# Altium schematic sheet type-C.SchDoc
size A4; SheetNumber: 2; SheetTotal: 2
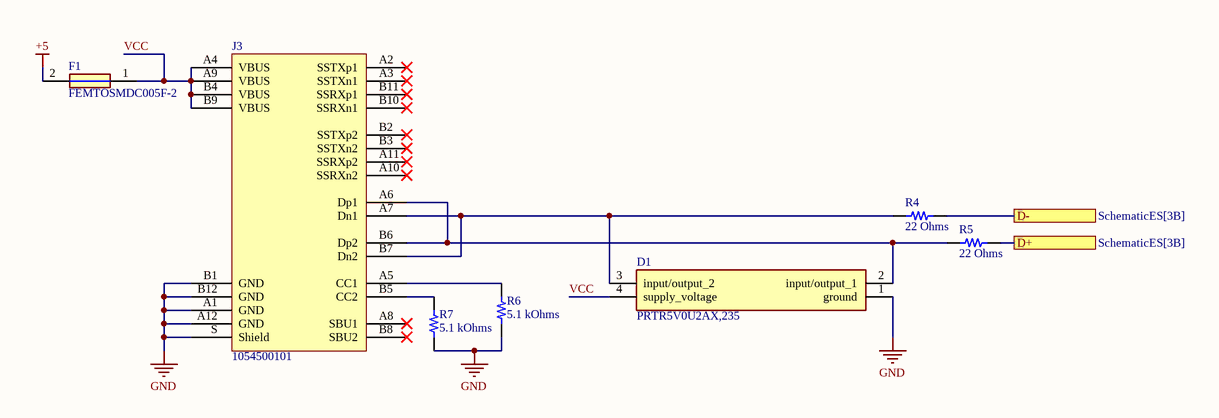
[diagram p0: type-C.SchDoc]

## Parts
D1  PRTR5V0U2AX,235  [PRTR5V0U2X]
F1  FEMTOSMDC005F-2  [FUSC1608X85N]
J3  1054500101  [Molex 1054500101]
R4  22 Ohms  [RES 0805_2012]
R5  22 Ohms  [RES 0805_2012]
R6  5.1 kOhms  [RES 0805_2012]
R7  5.1 kOhms  [RES 0805_2012]

## Ports
D+ (see SchematicES[3B]), D- (see SchematicES[3B])

## Nets
+5: F1.2
GND: D1.1(ground) J3.A1(GND) J3.A12(GND) J3.B1(GND) J3.B12(GND) J3.S(Shield) R6.2 R7.2
D+: R5.2 ; port D+
D-: R4.2 ; port D-
VCC: D1.4(supply_voltage) F1.1 J3.A4(VBUS) J3.A9(VBUS) J3.B4(VBUS) J3.B9(VBUS)
NetD1_2: D1.2(input/output_1) J3.A6(Dp1) J3.B6(Dp2) R5.1
NetD1_3: D1.3(input/output_2) J3.A7(Dn1) J3.B7(Dn2) R4.1
NetJ3_A5: J3.A5(CC1) R6.1
NetJ3_B5: J3.B5(CC2) R7.1

Not connected (* = marked no-connect by the designer): J3 A2(SSTXp1)* A3(SSTXn1)* A8(SBU1)* A10(SSRXn2)* A11(SSRXp2)* B2(SSTXp2)* B3(SSTXn2)* B8(SBU2)* B10(SSRXn1)* B11(SSRXp1)*

## Notes on the sheet
- USB 3.0
  comectet as USB 2.0

## Library data of the parts
D1 = PRTR5V0U2AX,235: Diode; Manufacturer_Name: Nexperia; Datasheet Link: https://assets.nexperia.com/documents/data-sheet/PRTR5V0U2AX.pdf; Height: 1.1mm; Manufacturer_Part_Number: PRTR5V0U2AX,235; Mouser Part Number: 771-PRTR5V0U2AX,235; Mouser Price/Stock: https://www.mouser.co.uk/ProductDetail/Nexperia/PRTR5V0U2AX235?qs=PJ263BbL1t0gDzY9SQx1XQ%3D%3D; Arrow Part Number: PRTR5V0U2AX,235; Arrow Price/Stock: https://www.arrow.com/en/products/prtr5v0u2ax235/nexperia?region=nac
F1 = FEMTOSMDC005F-2: Fuse; Manufacturer_Name: LITTELFUSE; Datasheet Link: https://www.littelfuse.com/~/media/electronics/product_specifications/resettable_ptcs/littelfuse_ptc_femtosmdc005f_2_product_specification.pdf.pdf; Height: 0.85mm; Manufacturer_Part_Number: FEMTOSMDC005F-2; Mouser Part Number: 650-FEMTOSMDC005F-2; Mouser Price/Stock: https://www.mouser.co.uk/ProductDetail/Littelfuse/FEMTOSMDC005F-2?qs=pBN%2FbMTRZde7DjsO%252B0Ugag%3D%3D; Arrow Part Number: FEMTOSMDC005F-2; Arrow Price/Stock: https://www.arrow.com/en/products/femtosmdc005f-2/littelfuse?region=nac
J3 = 1054500101: CONN RCP USB3.1 TYPEC 24P SMD RA; Manufacturer: Molex; Connector Type: USB - C (Type - C); Current Rating (Amps): 0.25A, 1A, 5A; Gender: Receptacle; Mating Cycles: 10000; Number of Contacts: 24; Number of Ports: 1; Shielding: Shielded; Specifications: USB 3.1 (USB 3.1 Gen 2, Superspeed+); Voltage - Rated: 30VAC/DC; Part Number: 1054500101; ComponentLink1Description: Datasheet; ComponentLink1URL: https://www.molex.com/pdm_docs/ps/PS-105448-001.pdf; ComponentLink2Description: DigiKey Link; ComponentLink2URL: http://digikey.com/product-detail/en/molex/1054500101/WM12856CT-ND/5843891; LastUpdated: 6/6/2020 2:14:04 AM; Lifecycle Status: Active; Minimum Order: 1; Mounting Feature: Horizontal; Mounting Type: Surface Mount, Right Angle; Through Hole; Operating Temperature: -30°C ~ 85°C; Packaging: TapeAndReel; Part Status: Active; Price: 1.22; Series: 105445; Supplier 1: DigiKey; Supplier Part Number 1: WM12856CT-ND; Termination: Solder
R4 R5 = RPC0805JT22R0-UP: RES 22 OHM 5% 1/2W 0805; Manufacturer: Stackpole Electronics Inc; Power (Watts): 0.5W, 1/2W; Temperature Coefficient: ±200ppm/°C; Part Number: RPC0805JT22R0-UP; Value: 22 Ohms; ComponentLink1Description: Datasheet; ComponentLink1URL: https://www.seielect.com/catalog/sei-rpc.pdf; ComponentLink2Description: DigiKey Link; ComponentLink2URL: https://www.digikey.com/en/products/detail/stackpole-electronics-inc/RPC0805JT22R0-UP/10109042; Composition: Thick Film; Device Package: 0805 (2012 Metric); Features: Automotive AEC-Q200, Pulse Withstanding; Height - Seated (Max): 0.024" (0.60mm); LastUpdated: 2/8/2024 9:02:06 PM; Lifecycle Status: Active; Minimum Order: 1; Number of Terminations: 2; Operating Temperature: -55°C ~ 155°C; Package / Case: 0805 (2012 Metric); Packaging: TapeAndReel; PartId: 35183; Part Status: Active; Price: 0.02; Ratings: AEC-Q200; Resistance: 22 Ohms; Series: RPC; Size / Dimension: 0.079" L x 0.049" W (2.00mm x 1.25mm); Supplier 1: DigiKey; Supplier Part Number 1: RPC0805JT22R0-UPCT-ND; Supplier Device Package: 0805; Tolerance: ±5%
R6 R7 = TNPW08055K10BEEA: RES 5.1K OHM 0.1% 1/8W 0805; Manufacturer: Vishay Dale; Power (Watts): 0.125W, 1/8W; Temperature Coefficient: ±25ppm/°C; Part Number: TNPW08055K10BEEA; Value: 5.1 kOhms; ComponentLink1Description: Datasheet; ComponentLink1URL: http://www.vishay.com/docs/28758/tnpw_e3.pdf; ComponentLink2Description: DigiKey Link; ComponentLink2URL: https://www.digikey.com/en/products/detail/vishay-dale/TNPW08055K10BEEA/1607362; Composition: Thin Film; Device Package: 0805 (2012 Metric); Features: Anti-Sulfur, Automotive AEC-Q200, Moisture Resistant; Height - Seated (Max): 0.022" (0.55mm); LastUpdated: 2/8/2024 9:01:56 PM; Lifecycle Status: Active; Minimum Order: 1; Number of Terminations: 2; Operating Temperature: -55°C ~ 155°C; Package / Case: 0805 (2012 Metric); Packaging: TapeAndReel; PartId: 37867; Part Status: Active; Price: 0.16; Ratings: AEC-Q200; Resistance: 5.1 kOhms; Series: TNPW e3; Size / Dimension: 0.079" L x 0.049" W (2.00mm x 1.25mm); Supplier 1: DigiKey; Supplier Part Number 1: 541-3809-1-ND; Supplier Device Package: 0805; Tolerance: ±0.1%